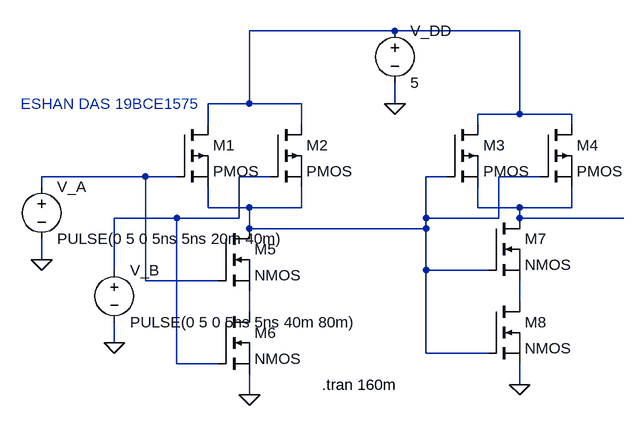
[diagram p0: schematic Draft9.asc]
Draft9.asc, the LTspice schematic file:
Version 4
SHEET 1 880 680
WIRE 288 -64 64 -64
WIRE 480 -64 288 -64
WIRE 64 48 64 -64
WIRE 64 48 0 48
WIRE 144 48 64 48
WIRE 288 48 288 16
WIRE 480 64 480 -64
WIRE 480 64 416 64
WIRE 560 64 480 64
WIRE 0 80 0 48
WIRE 144 80 144 48
WIRE 416 80 416 64
WIRE 560 80 560 64
WIRE -96 160 -256 160
WIRE -48 160 -96 160
WIRE 96 160 48 160
WIRE 368 160 336 160
WIRE 512 160 448 160
WIRE -256 176 -256 160
WIRE 0 208 0 176
WIRE 64 208 0 208
WIRE 144 208 144 176
WIRE 144 208 64 208
WIRE 416 208 416 176
WIRE 480 208 416 208
WIRE 560 208 560 176
WIRE 560 208 480 208
WIRE -48 224 -144 224
WIRE 48 224 48 160
WIRE 48 224 -48 224
WIRE 336 224 336 160
WIRE 448 224 448 160
WIRE 448 224 336 224
WIRE 480 224 480 208
WIRE 640 224 480 224
WIRE 64 240 64 208
WIRE 336 240 336 224
WIRE 336 240 64 240
WIRE -256 288 -256 256
WIRE -144 304 -144 224
WIRE 336 304 336 240
WIRE 432 304 336 304
WIRE -96 320 -96 160
WIRE 16 320 -96 320
WIRE 480 352 480 320
WIRE 64 368 64 336
WIRE -144 416 -144 384
WIRE 336 432 336 304
WIRE 432 432 336 432
WIRE -48 448 -48 224
WIRE 16 448 -48 448
WIRE 480 480 480 448
WIRE 64 496 64 464
FLAG -256 288 0
FLAG -144 416 0
FLAG 64 496 0
FLAG 480 480 0
FLAG 288 48 0
SYMBOL pmos -48 80 R0
SYMATTR InstName M1
SYMBOL pmos 96 80 R0
SYMATTR InstName M2
SYMBOL pmos 368 80 R0
SYMATTR InstName M3
SYMBOL pmos 512 80 R0
SYMATTR InstName M4
SYMBOL voltage -256 160 R0
WINDOW 123 0 0 Left 0
WINDOW 39 0 0 Left 0
SYMATTR InstName V_A
SYMATTR Value PULSE(0 5 0 5ns 5ns 20m 40m)
SYMBOL voltage -144 288 R0
WINDOW 123 0 0 Left 0
WINDOW 39 0 0 Left 0
SYMATTR InstName V_B
SYMATTR Value PULSE(0 5 0 5ns 5ns 40m 80m)
SYMBOL voltage 288 -80 R0
WINDOW 123 0 0 Left 0
WINDOW 39 0 0 Left 0
SYMATTR InstName V_DD
SYMATTR Value 5
SYMBOL nmos 16 240 R0
SYMATTR InstName M5
SYMBOL nmos 16 368 R0
SYMATTR InstName M6
SYMBOL nmos 432 224 R0
SYMATTR InstName M7
SYMBOL nmos 432 352 R0
SYMATTR InstName M8
TEXT 176 480 Left 2 !.tran 160m
TEXT -288 48 Left 2 ;ESHAN DAS 19BCE1575

The netlist it stands for:
* Draft9.asc
M1 N001 N002 N004 N004 PMOS
M2 N001 N003 N004 N004 PMOS
M3 N001 N004 N005 N005 PMOS
M4 N001 N004 N005 N005 PMOS
V_A N002 0 PULSE(0 5 0 5ns 5ns 20m 40m)
V_B N003 0 PULSE(0 5 0 5ns 5ns 40m 80m)
V_DD N001 0 5
M5 N004 N002 N007 N007 NMOS
M6 N007 N003 0 0 NMOS
M7 N005 N004 N006 N006 NMOS
M8 N006 N004 0 0 NMOS
.model NMOS NMOS
.model PMOS PMOS
.lib standard.mos
.tran 160m
* ESHAN DAS 19BCE1575
.backanno
.end